# Altium schematic sheet Regulador 5v FF21.SchDoc
size A4
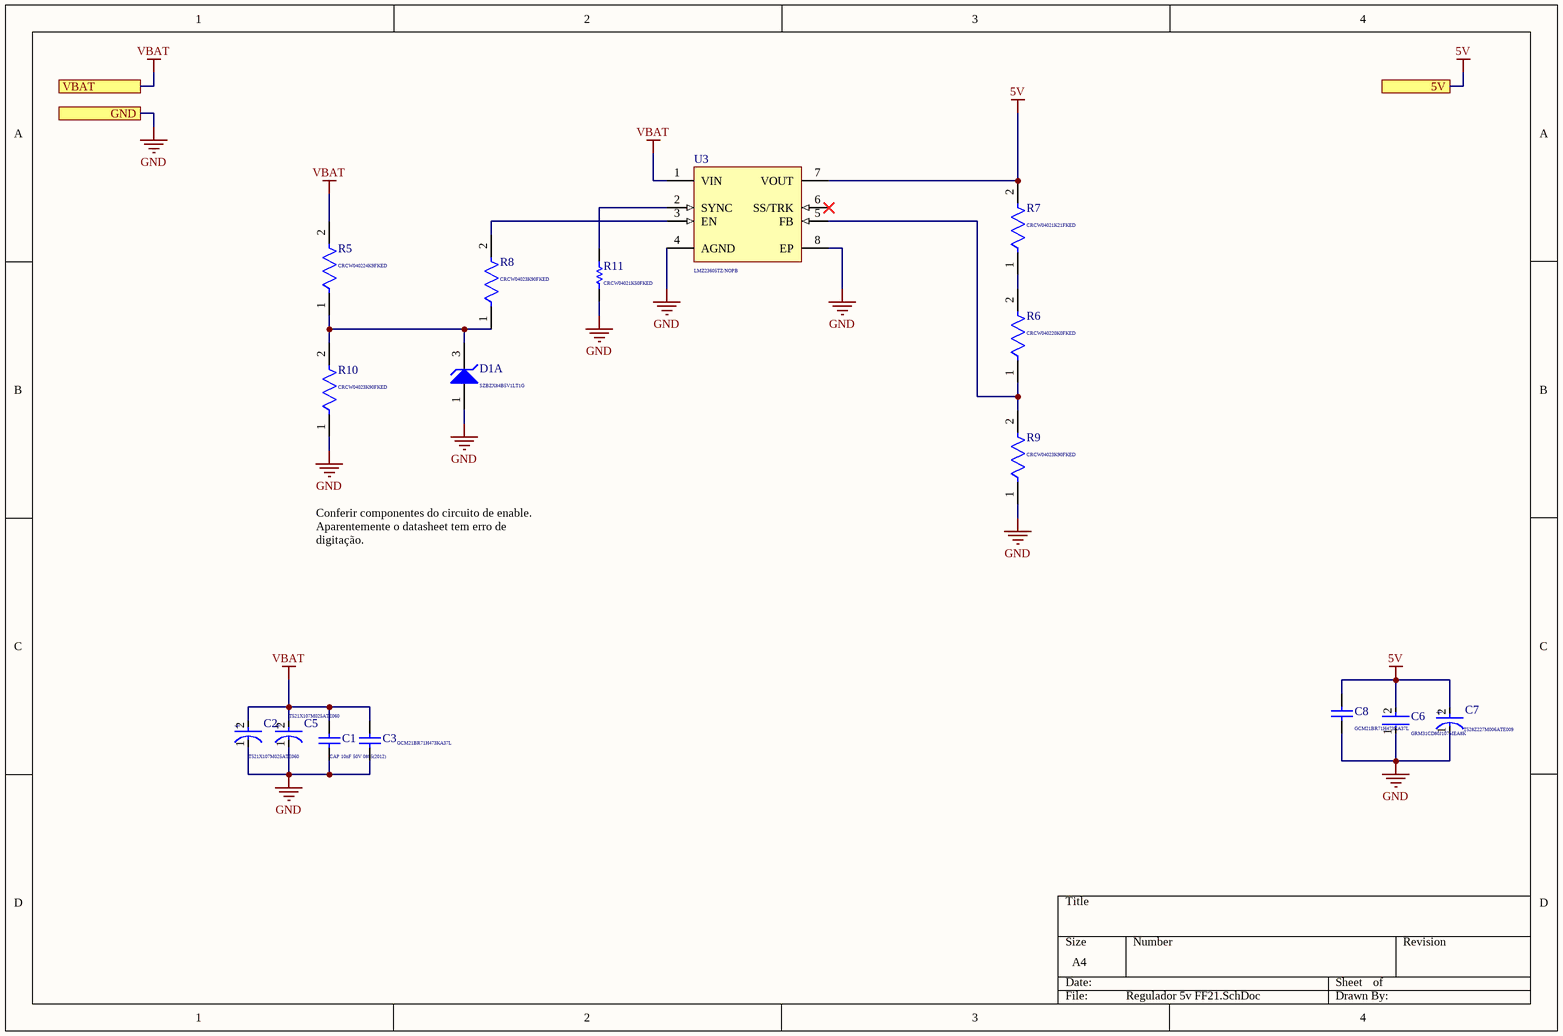
[diagram p0: Regulador 5v FF21.SchDoc]

## Parts
C1  CAP 10nF 50V 0805(2012)  [CAPC0805(2012)75_N]
C2  T521X107M025ATE060  [FP-T521X-MFG]
C3  GCM21BR71H473KA37L  [CAPC2013X140X45ML15T25]
C5  T521X107M025ATE060  [FP-T521X-MFG]
C6  GRM31CD80J107MEA8K  [FP-GRM31C-0_3-e0_3_0_8-IPC_A]
C7  T528Z227M006ATE009  [FP-T528Z227M006ATE009-MFG]
C8  GCM21BR71H473KA37L  [CAPC2013X140X45ML15T25]
D1  SZBZX84B5V1LT1G  [ONSC-SOT-23-3-318-08_V]  (part A of 2)
R5  CRCW040224K9FKED  [FP-CRCW0402-e3-IPC_C]
R6  CRCW040220K0FKED  [FP-CRCW0402-e3-IPC_B]
R7  CRCW04021K21FKED  [FP-CRCW0402-e3-IPC_B]
R8  CRCW04023K90FKED  [FP-CRCW0402-e3-MFG]
R9  CRCW04023K90FKED  [FP-CRCW0402-e3-MFG]
R10  CRCW04023K90FKED  [FP-CRCW0402-e3-MFG]
R11  CRCW04021K50FKED  [RESC1005X40X25NL05T05]
U3  LMZ23605TZ/NOPB  [NDW0007A_V]

## Ports
5V, GND, VBAT

## Nets
5V: C6.2 C7.2(A) C8.2 R7.2 U3.7(VOUT) ; port 5V
GND: C1.1 C2.1(C) C3.1 C5.1(C) C6.1 C7.1(C) C8.1 D1.1(A) R9.1 R10.1 R11.1 U3.4(AGND) U3.8(EP) ; port GND
VBAT: C1.2 C2.2(A) C3.2 C5.2(A) R5.2 U3.1(VIN) ; port VBAT
NetD1_3: D1.3(K) R5.1 R8.1 R10.2
NetR6_1: R6.1 R9.2 U3.5(FB)
NetR6_2: R6.2 R7.1
NetR8_2: R8.2 U3.3(EN)
NetR11_2: R11.2 U3.2(SYNC)

Not connected (* = marked no-connect by the designer): U3 6(SS/TRK)*

## Notes on the sheet
- Conferir componentes do circuito de enable. Aparentemente o datasheet tem erro de digitação.
- (in symbol CMP-03017-000004-1) +
- (in symbol CMP-03017-000006-1) +

## Library data of the parts
C1 = CMP-1036-03839-1: CAP 10nF 50V ±5% 0805 (2012 Metric) Thickness 0.75mm SMD; Case-Metric: 2012; Case-EIA: 0805; Tolerance: Â±5%; Technology: SMT; Max Thickness: 0.75 mm; Rated Voltage: 50 V; Value: 10nF
C2 C5 = CMP-03017-000004-1: CAP TANT POLY 100UF 25V 2917; Polarity: Polar; Tolerance: 20%; Life (Hours): 2000Hour; ESR (Equivalent Series Resistance): 60mR; Dissipation Factor: 10%; Voltage Rating (DC): 25V; Features: General Purpose; Length: 7.3mm; Case/Package: 2917; Max Operating Temperature: 105°C; Construction: Flat; Capacitance: 100uF; Min Operating Temperature: -55°C; Package Quantity: 1; RoHS Compliant: Yes; Height: 4mm; Depth: 4.3mm; REACH SVHC: No SVHC; Termination: SMD/SMT; Width: 4.3mm; Case Code (Metric): 7343; Height - Seated (Max): 0.169inch; Case Code (Imperial): 2917; Radiation Hardening: No; Voltage Rating: 25V; Mount: Surface Mount; Packaging: Tape and Reel; Series: KO-CAP T521
C3 C8 = CMP-2007-03359-1: Manufacturer: Murata; Part Number: GCM21BR71H473KA37L
C6 = CMP-06035-046129-1: Chip Multilayer Ceramic Capacitors for General Purpose, 1206, 100uF, X6T, +22%/-33%, 20%, 6.3V
C7 = CMP-03017-000006-1: CAP TANT POLY 220UF 6.3V 2917; Tolerance: 20%; Dissipation Factor: 10%; ESR (Equivalent Series Resistance): 9mR; Ripple Current: 6A; Leakage Current: 138.6uA; Polarity: Polar; Mount: Surface Mount; Termination: SMD/SMT; Features: General Purpose; Case Code (Imperial): 2917; Min Operating Temperature: -55°C; Height - Seated (Max): 0.067inch; Depth: 4.3mm; Package Quantity: 1; Voltage Rating (DC): 6.3V; Max Operating Temperature: 105°C; Capacitance: 220uF; Packaging: Tape and Reel; Voltage Rating: 6.3V; Case/Package: 2917; Construction: Flat; REACH SVHC: No SVHC; Width: 4.3mm; RoHS Compliant: Yes; Height: 1.7mm; Case Code (Metric): 7343; Length: 7.3mm; Series: KO-CAP T528
D1 = CMP-1060-00895-1: Zener Voltage Regulator, 225 mW, 3-Pin SOT-23, Pb-Free, Tape and Reel; Manufacturer: On Semiconductor; VZ Typ (V): 5.1; ComponentLink3URL: http://www.onsemi.cn/pub_link/Collateral/318-08.PDF; ComponentLink2Description: Datasheet; PackageVersion: Rev. AP, 11/2009; ComponentLink3Description: Package Specification; PartNumber: SZBZX84B5V1LT1G; DatasheetVersion: Rev. 17; RoHS: Pb-Free; Mounting Technology: Surface Mount; ComponentLink2URL: http://www.onsemi.com/pub_link/Collateral/BZX84C2V4LT1-D.PDF; PackageDescription: 3-Pin Small Outline Transistor, Body 2.92 x 1.3 mm, Pitch 0.95 mm; ComponentLink1Description: Manufacturer URL; PackageReference: SOT-23-3-318-08; ComponentLink1URL: http://www.onsemi.com/; Packing: Tape and Reel
R5 = CMP-2002-08407-2: RES Thick Film, 24.9kΩ, 1%, 0.063W, 100ppm/°C, 0402; Voltage Rating (DC): 50V; Resistance: 24.9kR; Power Rating: 63mW; Temperature Coefficient: 100ppm/°C; Case/Package: 0402; Length: 1mm; Radiation Hardening: No; Case Code (Imperial): 0402; Lead Free: Lead Free; Military Standard: Not; Composition: Thick Film; Tolerance: 1%; Min Operating Temperature: -55°C; Height: 0.35mm; Mount: Surface Mount; Max Operating Temperature: 155°C; Packaging: Tape and Reel; Case Code (Metric): 1005; Number of Terminations: 2; Contact Plating: Tin; Voltage Rating: 50V; Weight: 2.3E-05oz; Termination: SMD/SMT; Width: 0.5mm; Max Power Dissipation: 63mW; Number of Pins: 2; Features: Automotive AEC-Q200; Depth: 0.5mm; Package Quantity: 10
R6 = CMP-2002-08356-2: RES Thick Film, 20kΩ, 1%, 0.063W, 100ppm/°C, 0402; Max Power Dissipation: 63mW; Working Voltage: 50V; Resistance: 20kR; Contact Plating: Tin; Packaging: Tape and Reel; Height: 0.35mm; Case Code (Imperial): 0402; Tolerance: 1%; Width: 0.5mm; Composition: Thick Film; Mount: Surface Mount; Termination: SMD/SMT; Number of Pins: 2; Number of Terminations: 2; Length: 1mm; Temperature Coefficient: 100ppm/°C; Case Code (Metric): 1005; Voltage Rating: 50V; Lead Free: Lead Free; Voltage Rating (DC): 50V; Min Operating Temperature: -55°C; Max Operating Temperature: 155°C; Package Quantity: 10; Radiation Hardening: No; Weight: 2.3E-05oz; Military Standard: Not; Case/Package: 0402; Power Rating: 63mW; Depth: 0.5mm; Features: Automotive AEC-Q200
R7 = CMP-2002-08286-2: RES Thick Film, 1.21kΩ, 1%, 0.063W, 100ppm/°C, 0402; Power Rating: 63mW; Resistance: 1.21kR; Voltage Rating (DC): 50V; Case/Package: 0402; Number of Terminations: 2; Height: 0.35mm; Width: 0.02inch; Temperature Coefficient: 100ppm/°C; Number of Pins: 2; Military Standard: Not; Contact Plating: Tin; Tolerance: 1%; Length: 1mm; Features: Automotive AEC-Q200; Composition: Thick Film; Lead Free: Lead Free; Radiation Hardening: No; Min Operating Temperature: -55°C; Weight: 2.3E-05oz; Case Code (Metric): 1005; Max Power Dissipation: 63mW; Packaging: Tape and Reel; Max Operating Temperature: 155°C; Termination: SMD/SMT; Voltage Rating: 50V; Package Quantity: 10; Depth: 0.5mm; Case Code (Imperial): 0402
R8-R10 = CMP-2002-08592-2: RES Thick Film, 3.9kΩ, 1%, 0.063W, 100ppm/°C, 0402; Max Power Dissipation: 63mW; Working Voltage: 50V; Resistance: 3.9kR; Lead Free: Lead Free; Case Code (Metric): 1005; Number of Terminations: 2; Tolerance: 1%; Features: Automotive AEC-Q200; Width: 0.5mm; Case/Package: 0402; Height: 0.35mm; Case Code (Imperial): 0402; Contact Plating: Tin; Weight: 2.3E-05oz; Temperature Coefficient: 100ppm/°C; Max Operating Temperature: 155°C; Termination: SMD/SMT; Voltage Rating (DC): 50V; Package Quantity: 10; Power Rating: 63mW; Voltage Rating: 50V; Length: 1mm; Military Standard: Not; Depth: 0.5mm; Composition: Thick Film; Min Operating Temperature: -55°C; Radiation Hardening: No; Packaging: Tape and Reel
R11 = CMP-2002-08297-1: Manufacturer: Vishay Dale; Part Number: CRCW04021K50FKED
U3 = CMP-0069-02058-2: 5A SIMPLE SWITCHER® Power Module with 36V Maximum Input Voltage, 7 pin TO-PMOD, 45 Rail; Manufacturer: Texas Instruments; PackageTopMarking: NSUZXYTTE#*LMZ23605; PowerWise: N; PinCount: 7; ComponentLink1URL: http://www.ti.com/general/docs/lit/getliterature.tsp?genericPartNumber=LMZ23605&fileType=pdf; PackageDescription: TO-PMOD-7, 10.16 x 9.85 x 4.57 mm Body, 7 Lead, 1.27mm Pitch, Surface Mount; CompType: Switcher; ComponentLink1Description: Datasheet URL; RoHS: Y; PackageReference: NDW0007A